# Altium project F_ROM.PrjPcb
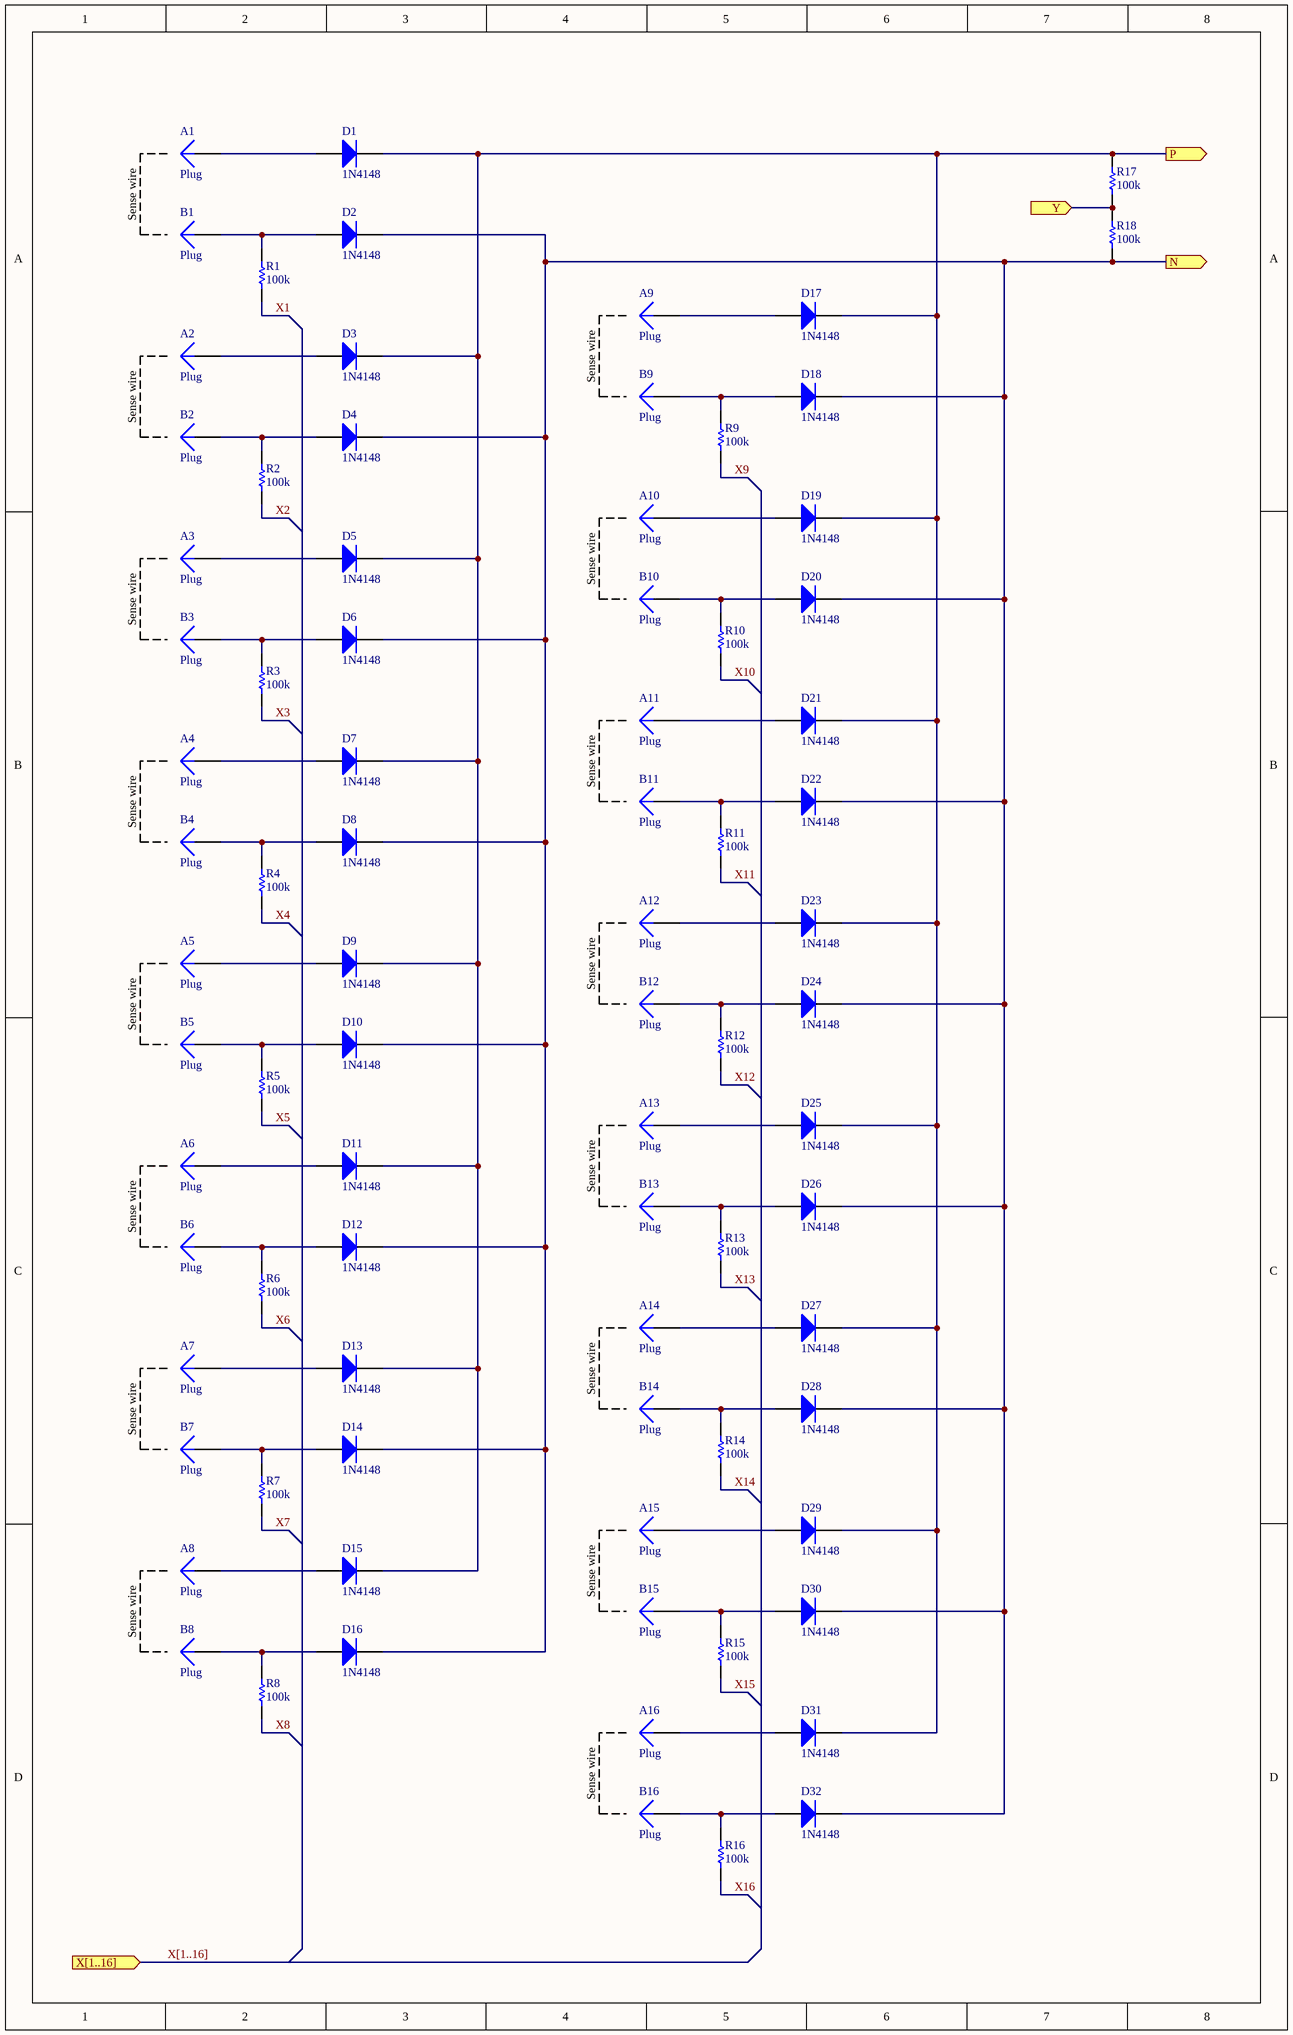
[diagram p0: SenseEnable.SchDoc]
1 sheet, 82 parts. Net scope: flat (ports and power ports of the same name join across sheets).
Board file: F_ROM.PcbDoc

## Sheet SenseEnable.SchDoc
size B portrait; Author: E. Sims; Organization: Let's Build Rockets Inc.; SheetNumber: 2; SheetTotal: 2

### Parts
A1  Plug  [PIN1]
A2  Plug  [PIN1]
A3  Plug  [PIN1]
A4  Plug  [PIN1]
A5  Plug  [PIN1]
A6  Plug  [PIN1]
A7  Plug  [PIN1]
A8  Plug  [PIN1]
A9  Plug  [PIN1]
A10  Plug  [PIN1]
A11  Plug  [PIN1]
A12  Plug  [PIN1]
A13  Plug  [PIN1]
A14  Plug  [PIN1]
A15  Plug  [PIN1]
A16  Plug  [PIN1]
B1  Plug  [PIN1]
B2  Plug  [PIN1]
B3  Plug  [PIN1]
B4  Plug  [PIN1]
B5  Plug  [PIN1]
B6  Plug  [PIN1]
B7  Plug  [PIN1]
B8  Plug  [PIN1]
B9  Plug  [PIN1]
B10  Plug  [PIN1]
B11  Plug  [PIN1]
B12  Plug  [PIN1]
B13  Plug  [PIN1]
B14  Plug  [PIN1]
B15  Plug  [PIN1]
B16  Plug  [PIN1]
D1  1N4148  [DO-35]
D2  1N4148  [DO-35]
D3  1N4148  [DO-35]
D4  1N4148  [DO-35]
D5  1N4148  [DO-35]
D6  1N4148  [DO-35]
D7  1N4148  [DO-35]
D8  1N4148  [DO-35]
D9  1N4148  [DO-35]
D10  1N4148  [DO-35]
D11  1N4148  [DO-35]
D12  1N4148  [DO-35]
D13  1N4148  [DO-35]
D14  1N4148  [DO-35]
D15  1N4148  [DO-35]
D16  1N4148  [DO-35]
D17  1N4148  [DO-35]
D18  1N4148  [DO-35]
D19  1N4148  [DO-35]
D20  1N4148  [DO-35]
D21  1N4148  [DO-35]
D22  1N4148  [DO-35]
D23  1N4148  [DO-35]
D24  1N4148  [DO-35]
D25  1N4148  [DO-35]
D26  1N4148  [DO-35]
D27  1N4148  [DO-35]
D28  1N4148  [DO-35]
D29  1N4148  [DO-35]
D30  1N4148  [DO-35]
D31  1N4148  [DO-35]
D32  1N4148  [DO-35]
R1  value 100k  [AXIAL-0.3]
R2  value 100k  [AXIAL-0.3]
R3  value 100k  [AXIAL-0.3]
R4  value 100k  [AXIAL-0.3]
R5  value 100k  [AXIAL-0.3]
R6  value 100k  [AXIAL-0.3]
R7  value 100k  [AXIAL-0.3]
R8  value 100k  [AXIAL-0.3]
R9  value 100k  [AXIAL-0.3]
R10  value 100k  [AXIAL-0.3]
R11  value 100k  [AXIAL-0.3]
R12  value 100k  [AXIAL-0.3]
R13  value 100k  [AXIAL-0.3]
R14  value 100k  [AXIAL-0.3]
R15  value 100k  [AXIAL-0.3]
R16  value 100k  [AXIAL-0.3]
R17  value 100k  [AXIAL-0.3]
R18  value 100k  [AXIAL-0.3]

### Ports
N (out), P (out), X[1..16] (in), Y (in)

### Nets
X1: R1.2
X2: R2.2
X3: R3.2
X4: R4.2
X5: R5.2
X6: R6.2
X7: R7.2
X8: R8.2
X9: R9.2
X10: R10.2
X11: R11.2
X12: R12.2
X13: R13.2
X14: R14.2
X15: R15.2
X16: R16.2
NetA1_1: A1.1 D1.1(A)
NetA2_1: A2.1 D3.1(A)
NetA3_1: A3.1 D5.1(A)
NetA4_1: A4.1 D7.1(A)
NetA5_1: A5.1 D9.1(A)
NetA6_1: A6.1 D11.1(A)
NetA7_1: A7.1 D13.1(A)
NetA8_1: A8.1 D15.1(A)
NetA9_1: A9.1 D17.1(A)
NetA10_1: A10.1 D19.1(A)
NetA11_1: A11.1 D21.1(A)
NetA12_1: A12.1 D23.1(A)
NetA13_1: A13.1 D25.1(A)
NetA14_1: A14.1 D27.1(A)
NetA15_1: A15.1 D29.1(A)
NetA16_1: A16.1 D31.1(A)
NetB1_1: B1.1 D2.1(A) R1.1
NetB2_1: B2.1 D4.1(A) R2.1
NetB3_1: B3.1 D6.1(A) R3.1
NetB4_1: B4.1 D8.1(A) R4.1
NetB5_1: B5.1 D10.1(A) R5.1
NetB6_1: B6.1 D12.1(A) R6.1
NetB7_1: B7.1 D14.1(A) R7.1
NetB8_1: B8.1 D16.1(A) R8.1
NetB9_1: B9.1 D18.1(A) R9.1
NetB10_1: B10.1 D20.1(A) R10.1
NetB11_1: B11.1 D22.1(A) R11.1
NetB12_1: B12.1 D24.1(A) R12.1
NetB13_1: B13.1 D26.1(A) R13.1
NetB14_1: B14.1 D28.1(A) R14.1
NetB15_1: B15.1 D30.1(A) R15.1
NetB16_1: B16.1 D32.1(A) R16.1
NetD1_2: D1.2(K) D3.2(K) D5.2(K) D7.2(K) D9.2(K) D11.2(K) D13.2(K) D15.2(K) D17.2(K) D19.2(K) D21.2(K) D23.2(K) D25.2(K) D27.2(K) D29.2(K) D31.2(K) R17.1 ; port P
NetD2_2: D2.2(K) D4.2(K) D6.2(K) D8.2(K) D10.2(K) D12.2(K) D14.2(K) D16.2(K) D18.2(K) D20.2(K) D22.2(K) D24.2(K) D26.2(K) D28.2(K) D30.2(K) D32.2(K) R18.2 ; port N
NetR17_2: R17.2 R18.1 ; port Y

### Buses and harness runs
bus X[1..16] = port X[1..16]

### Notes on the sheet
- Sense wire
- Let's Build Rocket's Inc. Modular Paylaod System Based on TMP-010 Rev
  For more information visit https://github.com/LetsBuildRockets/Modular-Payload-System
  This work is licensed under CC BY-NC 4.0. To view a copy of this license, visit https://creativecommons.org/licenses/by-nc/4.0
- Title
- Size:
- Date:
- Assembly Variant:
- B
- Number:
- Time:
- Revision:
- Sheet
- of
- Author:
- File:

### Library data of the parts
D1-D32 = Diode 1N4148: High Conductance Fast Diode; Published: 8-Jun-2000; LatestRevisionDate: 17-Jul-2002; LatestRevisionNote: Re-released for DXP Platform.; DatasheetVersion: 1997; PackageReference: DO-35; Publisher: Altium Limited; PackageDescription: Diode, Axial; Body 3.8 x 1.9 mm (LxDia. max), Lead Dia. 0.53 mm (max); Code_JEDEC: DO-204-AH; ComponentLink1Description: Manufacturer Link; ComponentLink1URL: http://www.fairchildsemi.com/; ComponentLink2Description: Datasheet; ComponentLink2URL: http://www.fairchildsemi.com/ds/1N%2F1N4148.pdf
R1-R18 = Res1: Resistor; Published: 8-Jun-2000; LatestRevisionDate: 17-Jul-2002; LatestRevisionNote: Re-released for DXP Platform.; PackageReference: AXIAL-0.3; Publisher: Altium Limited; PackageDescription: Axial Device, Thru-Hole; 2 Leads; 0.3 in Pin Spacing
A1-A16 B1-B16 = Plug: LatestRevisionDate: 17-Jul-2002; LatestRevisionNote: Re-released for DXP Platform.; Publisher: Altium Limited